# EAGLE design plant_reminder (EAGLE 8.7.1)
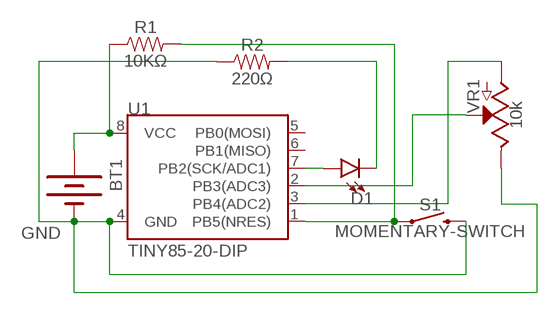
[diagram p0: schematic, sheet 1]

## Parts
BT1  BATTERYFOB  [BATTERY_20MM_PTH_COMPACT]
D1  LED5MM-KIT  [LED_5MM-KIT]
R1  10KΩ  10OHM-HORIZ-1/4W-1%  [AXIAL-0.3]
R2  220Ω  RESISTORAXIAL-0.3  [AXIAL-0.3]
S1  MOMENTARY-SWITCH  MOMENTARY-SWITCH-SPST-PTH-6.0MM  [TACTILE_SWITCH_PTH_6.0MM]
U1  TINY85-20-DIP  ATTINY45TINY85-20-DIP  [DIP08_MCU]
VR1  10k  POTENTIOMETER-PTH-9MM-1/20W-20%-KIT  [POT-PTH-ALPS-KIT]

## Nets
GND: BT1.2(-) R2.P$1 S1.3 U1.4(GND) VR1.P$1(E)
N$3: R1.P$2 S1.1 U1.1(PB5(NRES))
N$4: D1.A U1.7(PB2(SCK/ADC1))
N$5: D1.K(C) R2.P$2
N$6: U1.2(PB3(ADC3)) VR1.P$2(S)
N$8: U1.3(PB4(ADC2)) VR1.P$3(A)
VCC: BT1.1(+) R1.P$1 U1.8(VCC)
Unconnected: U1.5(PB0(MOSI)) U1.6(PB1(MISO))

## Library data of the parts
BT1 = SparkFun-Retired:BATTERY: Battery - Single Cell A variety of battery chemistries, sizes, and footprints. Including AA, AAA, 18650 (PRT-12895), 20mm coin cell and 12mm coin cell. 20MM_4LEGS, BATT-10373
D1 = SparkFun-LED:LED: LED (Generic) Standard schematic elements and footprints for 5mm, 3mm, 1206, and 0603 sized LEDs. Generic LEDs with no color specified.
R1 = SparkFun-Resistors:10OHM: 10Ω resistor A resistor is a passive two-terminal electrical component that implements electrical resistance as a circuit element. Resistors act to reduce current flow, and, at the same time, act to lower voltage levels within circuits. - Wikipedia; PROD_ID: RES-12180; VALUE: 10
R2 = SparkFun-Resistors:RESISTOR: Generic Resistor Package
S1 = SparkFun-Switches:MOMENTARY-SWITCH-SPST: Momentary Switch (Pushbutton) - SPST Normally-open (NO) SPST momentary switches (buttons, pushbuttons). Variants PTH-12MM - 12mm square, through-hole Momentary Pushbutton Switch - 12mm Square <https://www.sparkfun.com/products/9190> (COM-09190) PTH-6.0MM, PTH-6.0MM-KIT - 6.0mm square, through-hole Mini Pushbutton Switch <https://www.sparkfun.com/products/97> (COM-00097) KIT package intended for soldering kit's - only one side of pads' copper is exposed. PTH-RIGHT-ANGLE-KIT - Right-angle, through-hole Right Angle Tactile Button <https://www.sparkfun.com/products/10791> - Used on SparkFun BigTime Watch Kit <https://www.sparkfun.com/products/11734> SMD-12MM - 12mm square, surface-mount Tactile Button - SMD (12mm) <https://www.sparkfun.com/products/12993> (COM-12993) Used on SparkFun PicoBoard <https://www.sparkfun.com/products/11888> SMD-4.5MM - 4.5mm Square Trackball Switch Used on SparkFun Blackberry Trackballer Breakout <https://www.sparkfun.com/products/13169> SMD-4.6MMX2.8MM - 4.60mm x 2.80mm, surface mount Used on SparkFun SAMD21 Mini Breakout <https://www.sparkfun.com/products/13664> SMD-5.2MM, SMD-5.2-REDUNDANT - 5.2mm square, surface-mount Mini Pushbutton Switch - SMD <https://www.sparkfun.com/products/8720> (COM-08720) Used on Arduino Pro Mini <https://www.sparkfun.com/products/11114> REDUNDANT package connects both switch circuits together SMD-6.0X3.5MM - 6.0 x 3.5mm, surface mount Momentary Reset Switch SMD <https://www.sparkfun.com/products/8229> (COM-08229) SMD-6.2MM-TALL - 6.2mm square, surface mount Tactile Button - SMD (6mm) <https://www.sparkfun.com/products/12992> Used on SparkFun Digital Sandbox <https://www.sparkfun.com/products/12651> SMD-RIGHT-ANGLE - Right-angle, surface mount Used on SparkFun Block for Intel® Edison - Arduino <https://www.sparkfun.com/products/13036>; PROD_ID: SWCH-08441; SF_SKU: COM-00097
U1 = SparkFun-Retired:ATTINY45: Atmel 8-pin 2/4/8kB flash uC Retired; PROD_ID: IC-09445
VR1 = SparkFun-Resistors:POTENTIOMETER: Potentiometer (Pot) Three-terminal potentiometers, with an adjustable wiper and two adjustable resistors. A pot can be used to create a configurable voltage divider, or as a variable resistor. Variants ALPS_POT and ALPS_POT_KIT - PTH, breadboard compatible, 9mm square pots Rotary Potentiometer - Linear (10k ohm) <https://www.sparkfun.com/products/9288> (COM-09288) The KIT variant exposes copper on only one side of the PTH pad, so the part can only be assembled on one side of the PCB. Useful for beginner soldering kits.; PROD_ID: RES-09177; SF_SKU: COM-09288

## Board
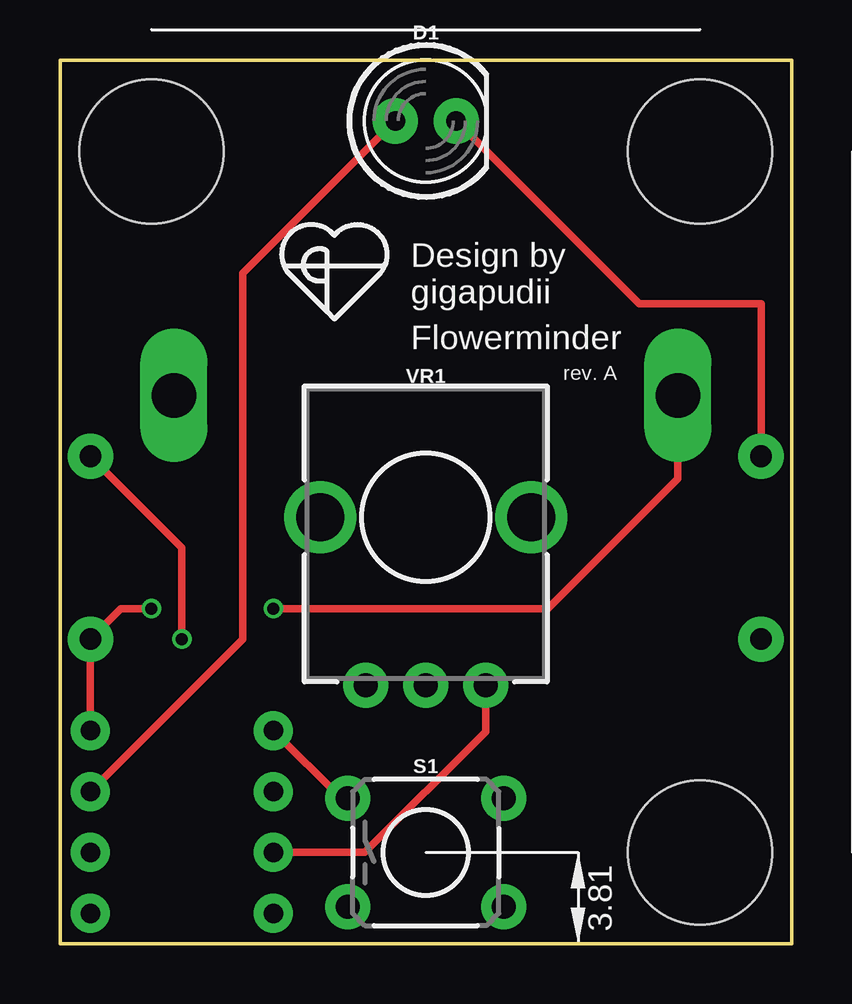
[diagram p1: board, top side]
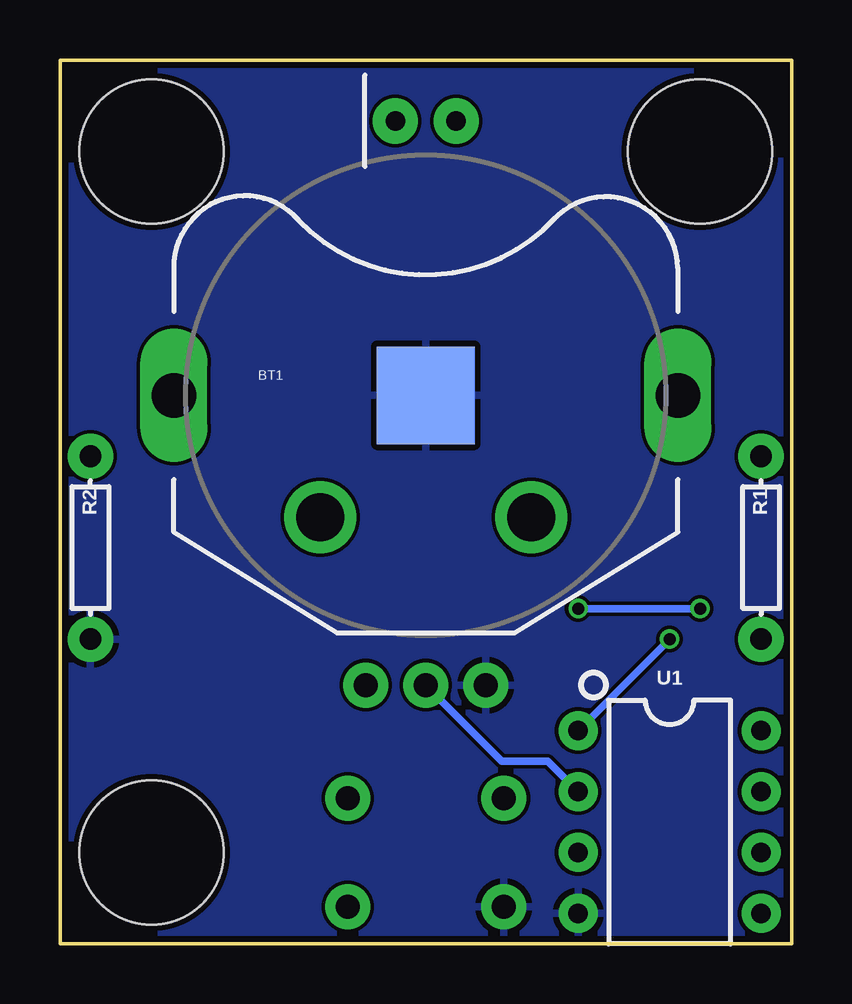
[diagram p2: board, bottom side, seen from below]

Size 30.48 x 36.83 mm. Coordinates in mm from the lower left corner, seen from the top.
Outline: 30.48,0 0,0 0,36.83 30.48,36.83 30.48,0
Copper layers (1*16): Top 0.035mm / dielectric 1.5mm / Bottom 0.035mm
Design rules "SeeedStudio_2layer_DRU_edited": minimum track width 7mil, minimum drill 15mil, track to track 6mil, track to pad 6mil, pad to pad 6mil, via to via 6mil, smd to smd 0mil, copper to edge 10mil, drill to drill 10mil, minimum pad ring 10mil, minimum via ring 6mil, stop-mask expansion 2mil, vias tented up to drill 100mil, thermal gap 10mil
Holes 6 mm at 3.81,33.02 26.67,33.02 26.67,3.81

### Footprints (pad centres in the part's own frame; a part is rotated, then mirrored left to right if it is on the bottom)
BATTERY_20MM_PTH_COMPACT = drill 1.854 long: 1 -10.5,0; 3 10.5,0 | smd 4.064 x 4.064: 2 0,0
LED_5MM-KIT = drill 0.813 pad 1.88: A -1.27,0; K 1.27,0
AXIAL-0.3 = drill 0.9 pad 1.88: P$1 -3.81,0; P$2 3.81,0
TACTILE_SWITCH_PTH_6.0MM = drill 1.016 pad 1.88: 1 -3.251,2.261; 2 3.251,2.261; 3 -3.251,-2.261; 4 3.251,-2.261
DIP08_MCU = drill 0.813 pad 1.626: 1 -3.81,-3.81; 2 -1.27,-3.81; 3 1.27,-3.81; 4 3.81,-3.81; 5 3.81,3.81; 6 1.27,3.81; 7 -1.27,3.81; 8 -3.81,3.81
POT-PTH-ALPS-KIT = drill 1 pad 1.88: P$1 7,-2.5; P$2 7,0; P$3 7,2.5 | drill 2: P$4 0,-4.4; P$5 0,4.4

### Placement (x,y rotation side)
BT1  15.24,22.86 0 bottom
D1  15.24,34.29 0 top
R1  1.27,16.51 90 bottom
R2  29.21,16.51 90 bottom
S1  15.24,3.81 0 top
U1  5.08,5.08 270 bottom
VR1  15.24,17.78 270 top

### Tracks (layer width: path | path; a pad name or v marks a point on that pad's centre or on a via)
GND
  pour Bottom: 0,36.83 0,0 30.48,0 30.48,36.83
N$3  (via drill 0.5)
  Top 0.305: R1.P$2 5.08,16.51 v5.08,12.7 | U1.1 11.71,6.07 S1.1
  Bottom 0.305: v5.08,12.7 U1.1
N$4
  Top 0.305: D1.A 7.62,27.94 7.62,12.7 U1.7
N$5
  Top 0.305: D1.K 24.13,26.67 29.21,26.67 R2.P$2
N$6
  Bottom 0.305: U1.2 10.16,7.62 12.08,7.62 VR1.P$2
N$8
  Top 0.305: U1.3 12.7,3.81 17.74,8.85 VR1.P$3
VCC  (via drill 0.5, 0.5 pad 0.8)
  Top 0.305: U1.8 R1.P$1 2.54,13.97 v3.81,13.97 | v8.89,13.97 20.32,13.97 25.74,19.39 BT1.1
  Bottom 0.305: v3.81,13.97 v8.89,13.97

### Text on the board
tPlace: Design by / gigapudii | Flowerminder | rev. A